# EAGLE schematic KarShield (EAGLE 7.2.0)
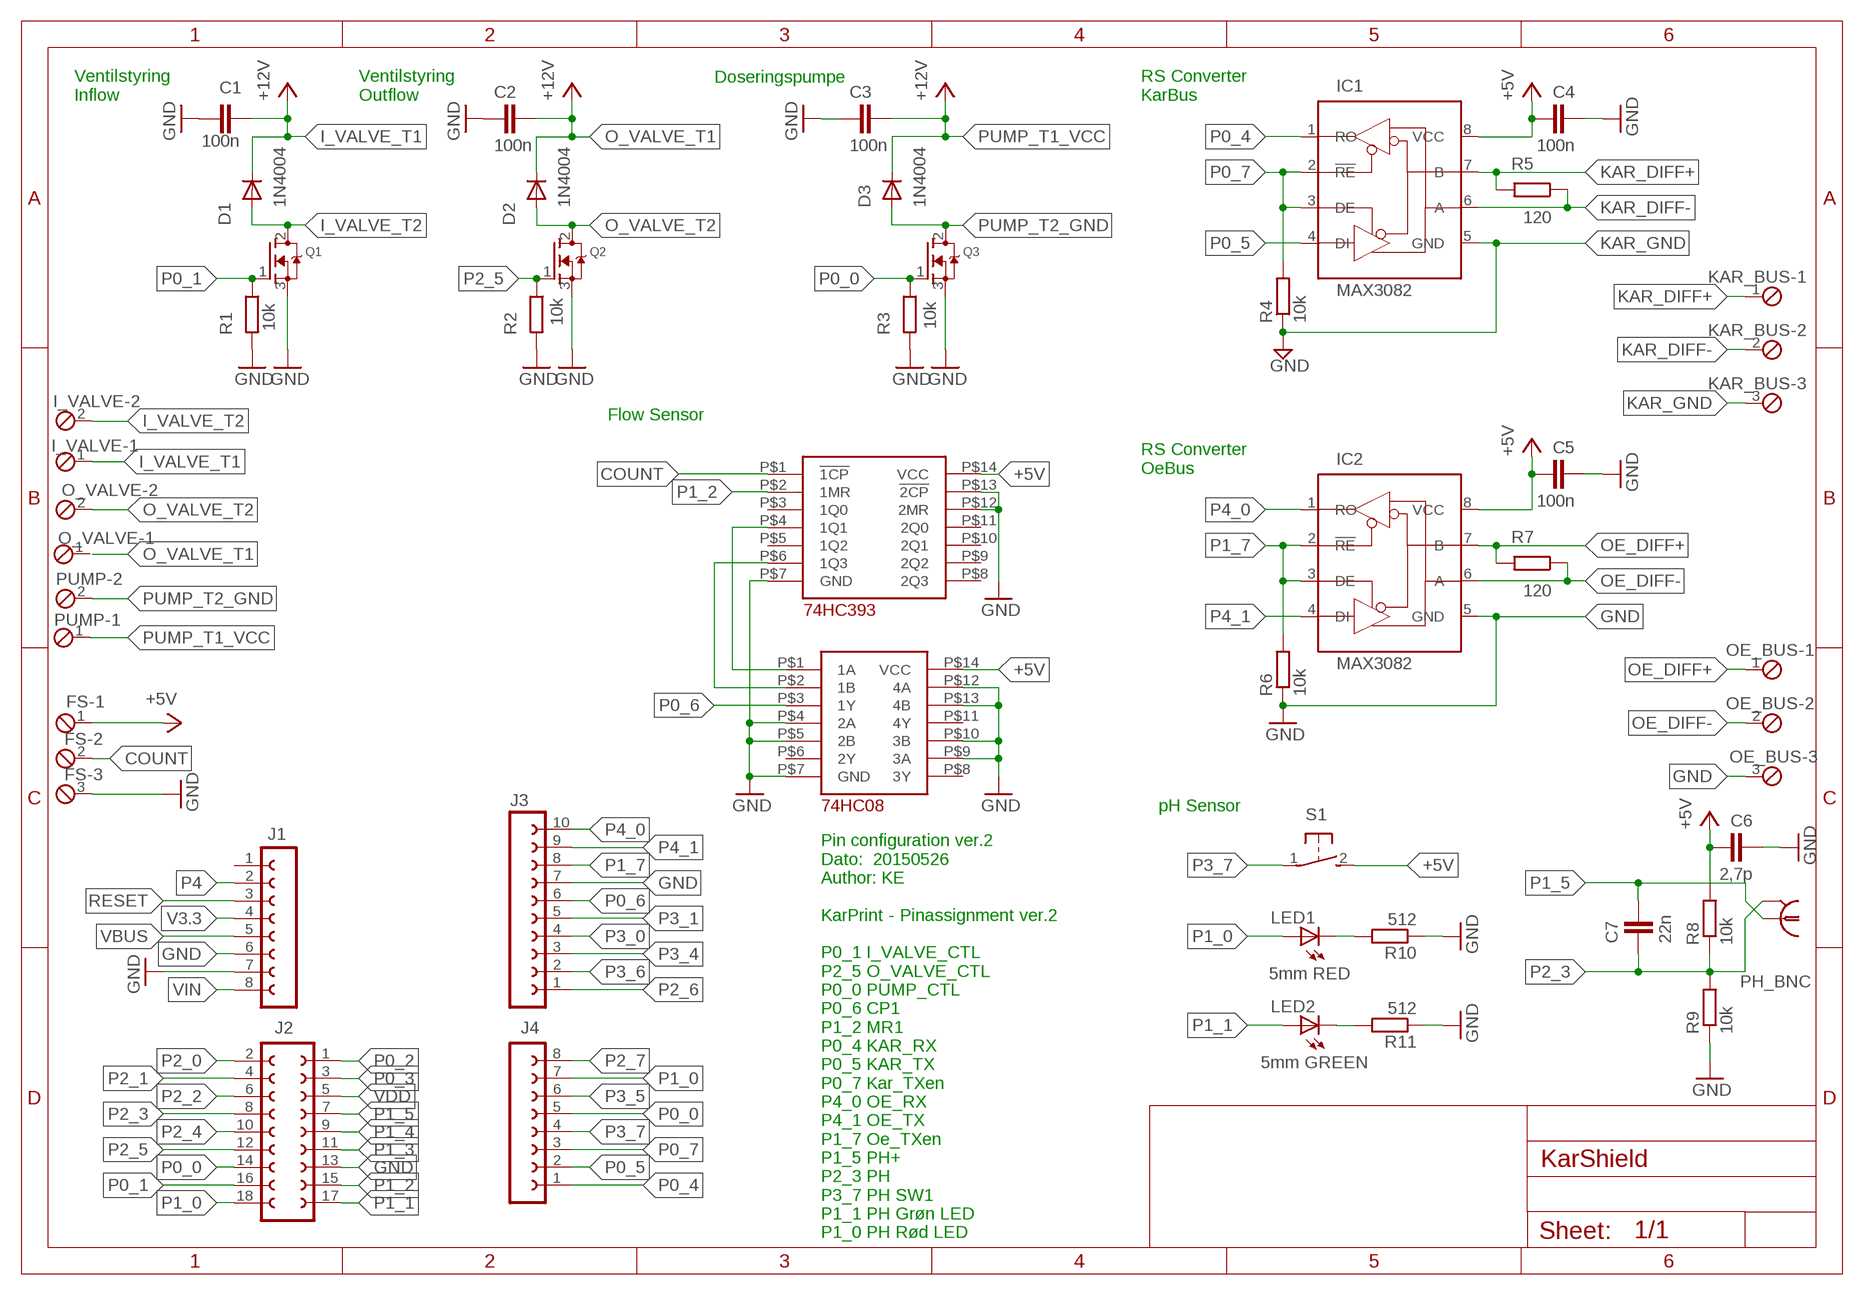
[diagram p0: schematic, sheet 1]

## Parts
74HC08  74HC08_KE  [74HC08_KE]
74HC393  HC74393_KEDIP14  [DIP14]
C1  100n  C5/3  [C5B3]
C2  100n  C5/3  [C5B3]
C3  100n  C5/3  [C5B3]
C4  100n  C5/3  [C5B3]
C5  100n  C5/3  [C5B3]
C6  2,7p  C5/3  [C5B3]
C7  22n  C5/3  [C5B3]
D1  1N4004  [DO41-10]
D2  1N4004  [DO41-10]
D3  1N4004  [DO41-10]
FS  MPT3  [3POL254]
I_VALVE  MPT2  [2POL254]
IC1  MAX3082  MAX3082CPD  [DIL08]
IC2  MAX3082  MAX3082CPD  [DIL08]
J1  FE08-1  [FE08]
J2  FE09-2  [FE09-2]
J3  FE10-1  [FE10]
J4  FE08-1  [FE08]
KAR_BUS  MPT3  [3POL254]
LED1  5mm RED  LED5MM  [LED5MM]
LED2  5mm GREEN  LED5MM  [LED5MM]
O_VALVE  MPT2  [2POL254]
OE_BUS  MPT3  [3POL254]
PH_BNC  1-227161-0  [AMP_227161]
PUMP  MPT2  [2POL254]
Q1  MOSFET-NGDS_TO220V  [TO220V]
Q2  MOSFET-NGDS_TO220V  [TO220V]
Q3  MOSFET-NGDS_TO220V  [TO220V]
R1  10k  R-EU_0207/12  [0207/12]
R2  10k  R-EU_0207/12  [0207/12]
R3  10k  R-EU_0207/12  [0207/12]
R4  10k  R-EU_0207/12  [0207/12]
R5  120  R-EU_0207/12  [0207/12]
R6  10k  R-EU_0207/12  [0207/12]
R7  120  R-EU_0207/12  [0207/12]
R8  10k  R-EU_0207/12  [0207/12]
R9  10k  R-EU_0207/12  [0207/12]
R10  512  R-EU_0207/12  [0207/12]
R11  512  R-EU_0207/12  [0207/12]
S1  31-XX  [B3F-31XX]

## Nets
+5V: 74HC08.P$14(VCC) 74HC393.P$14(VCC) FS.1 S1.2(S)
COUNT: 74HC393.P$1(!1CP!) FS.2
GND: 74HC08.P$4(2A) 74HC08.P$5(2B) 74HC08.P$7(GND) 74HC08.P$9(3A) 74HC08.P$10(3B) 74HC08.P$12(4A) 74HC08.P$13(4B) 74HC393.P$7(GND) 74HC393.P$12(2MR) 74HC393.P$13(!2CP!) C1.2 C2.2 C3.2 C4.2 C5.2 C6.2 FS.3 IC2.5(GND) J1.6 J1.7 J2.13 J3.7 OE_BUS.3 Q1.3(S) Q2.3(S) Q3.3(S) R1.2 R2.2 R3.2 R6.1 R9.1 R10.1 R11.1
I_VALVE_T1: C1.1 D1.C I_VALVE.1 ; supply symbol labelled +12V
I_VALVE_T2: D1.A I_VALVE.2 Q1.2(D)
KAR_DIFF+: IC1.7(B) KAR_BUS.1 R5.2
KAR_DIFF-: IC1.6(A) KAR_BUS.2 R5.1
KAR_GND: IC1.5(GND) KAR_BUS.3 R4.1 ; supply symbol labelled GND
N$3: LED1.K(C) R10.2
N$4: LED2.K(C) R11.2
N$8: 74HC08.P$1(1A) 74HC393.P$4(1Q1)
N$9: 74HC08.P$2(1B) 74HC393.P$6(1Q3)
O_VALVE_T1: C2.1 D2.C ; supply symbol labelled +12V
O_VALVE_T2: D2.A O_VALVE.2 Q2.2(D)
OE_DIFF+: IC2.7(B) OE_BUS.1 R7.2
OE_DIFF-: IC2.6(A) OE_BUS.2 R7.1
P0_0: J2.14 J4.5 Q3.1(G) R3.1
P0_1: J2.16 Q1.1(G) R1.1
P0_2: J2.1
P0_3: J2.3
P0_4: IC1.1(RO) J4.1
P0_5: IC1.4(DI) J4.2
P0_6: 74HC08.P$3(1Y) J3.6
P0_7: IC1.2(!RE!) IC1.3(DE) J4.3 R4.2
P1_0: J2.18 J4.7 LED1.A
P1_1: J2.17 LED2.A
P1_2: 74HC393.P$2(1MR) J2.15
P1_3: J2.11
P1_4: J2.9
P1_5: C7.1 J2.7 PH_BNC.1
P1_7: IC2.2(!RE!) IC2.3(DE) J3.8 R6.2
P2_0: J2.2
P2_1: J2.4
P2_2: J2.6
P2_3: C7.2 J2.8 PH_BNC.2 R8.1 R9.2
P2_4: J2.10
P2_5: J2.12 Q2.1(G) R2.1
P2_6: J3.1
P2_7: J4.8
P3_0: J3.4
P3_1: J3.5
P3_4: J3.3
P3_5: J4.6
P3_6: J3.2
P3_7: J4.4 S1.1(P)
P4: J1.2
P4_0: IC2.1(RO) J3.10
P4_1: IC2.4(DI) J3.9
PUMP_T1_VCC: C3.1 D3.C PUMP.1 ; supply symbol labelled +12V
PUMP_T2_GND: D3.A PUMP.2 Q3.2(D)
RESET: J1.3
V3.3: J1.4
VBUS: J1.5
VCC: C4.1 C5.1 C6.1 IC1.8(VCC) IC2.8(VCC) R8.2 ; supply symbol labelled +5V
VDD: J2.5
VIN: J1.8
Unconnected: 74HC08.P$6(2Y) 74HC08.P$8(3Y) 74HC08.P$11(4Y) 74HC393.P$3(1Q0) 74HC393.P$5(1Q2) 74HC393.P$8(2Q3) 74HC393.P$9(2Q2) 74HC393.P$10(2Q1) 74HC393.P$11(2Q0) J1.1 O_VALVE.1

## Notes on the sheet
- Doseringspumpe
- Ventilstyring
  Inflow
- Ventilstyring
  Outflow
- RS Converter
  KarBus
- Flow Sensor
- RS Converter
  OeBus
- pH Sensor
- Pin configuration ver.2
  Dato: 	20150526
  Author: KE
  
  KarPrint - Pinassignment ver.2
  
  P0_1 I_VALVE_CTL
  P2_5 O_VALVE_CTL	
  P0_0 PUMP_CTL
  P0_6 CP1			
  P1_2 MR1	
  P0_4 KAR_RX			
  P0_5 KAR_TX
  P0_7 Kar_TXen
  P4_0 OE_RX
  P4_1 OE_TX
  P1_7 Oe_TXen
  P1_5 PH+	
  P2_3 PH
  P3_7 PH SW1			
  P1_1 PH Grøn LED
  P1_0 PH Rød LED

## Library data of the parts
74HC08 = customIC:74HC08_KE
74HC393 = customIC:HC74393_KE
C1-C7 = capacitor-wima:C: CAPACITOR naming: grid - package width
D1-D3 = adafruit:1N4004: DIODE General purpose 1N400x type rectifier (With bigger pads) http://www.ladyada.net/library/pcb/eaglelibrary.html
FS KAR_BUS OE_BUS = con-phoenix-254:MPT3: PHOENIX CONNECTOR; OC_FARNELL: unknown; OC_NEWARK: unknown
I_VALVE O_VALVE PUMP = con-phoenix-254:MPT2: PHOENIX CONNECTOR; OC_FARNELL: unknown; OC_NEWARK: unknown
IC1 IC2 = myLibrary:MAX3082: RS485 transceiver Converting from logical RS232 to differential RS485, and vice versa.; OC_FARNELL: unknown; OC_NEWARK: unknown
J1 J4 = con-lsta:FE08-1: FEMALE HEADER; OC_FARNELL: unknown; OC_NEWARK: unknown
J2 = con-lsta:FE09-2: FEMALE HEADER; OC_FARNELL: unknown; OC_NEWARK: unknown
J3 = con-lsta:FE10-1: FEMALE HEADER; OC_FARNELL: unknown; OC_NEWARK: unknown
LED1 LED2 = adafruit:LED: LED OSRAM: - CHIPLED LG R971, LG N971, LY N971, LG Q971, LY Q971, LO R971, LY R971 LH N974, LH R974 LS Q976, LO Q976, LY Q976 LO Q996 - Hyper CHIPLED LW Q18S LB Q993, LB Q99A, LB R99A - SideLED LS A670, LO A670, LY A670, LG A670, LP A670 LB A673, LV A673, LT A673, LW A673 LH A674 LY A675 LS A676, LA A676, LO A676, LY A676, LW A676 LS A679, LY A679, LG A679 - Hyper Micro SIDELED® LS Y876, LA Y876, LO Y876, LY Y876 LT Y87S - SmartLED LW L88C, LW L88S LB L89C, LB L89S, LG L890 LS L89K, LO L89K, LY L89K LS L896, LA L896, LO L896, LY L896 - TOPLED LS T670, LO T670, LY T670, LG T670, LP T670 LSG T670, LSP T670, LSY T670, LOP T670, LYG T670 LG T671, LOG T671, LSG T671 LB T673, LV T673, LT T673, LW T673 LH T674 LS T676, LA T676, LO T676, LY T676, LB T676, LH T676, LSB T676, LW T676 LB T67C, LV T67C, LT T67C, LS T67K, LO T67K, LY T67K, LW E67C LS E67B, LA E67B, LO E67B, LY E67B, LB E67C, LV E67C, LT E67C LW T67C LS T679, LY T679, LG T679 LS T770, LO T770, LY T770, LG T770, LP T770 LB T773, LV T773, LT T773, LW T773 LH T774 LS E675, LA E675, LY E675, LS T675 LS T776, LA T776, LO T776, LY T776, LB T776 LHGB T686 LT T68C, LB T68C - Hyper Mini TOPLED® LB M676 - Mini TOPLED Santana® LG M470 LS M47K, LO M47K, LY M47K Source: http://www.osram.convergy.de/
PH_BNC = con-coax:?227161*: JACK, RIGHT ANGLE, 50 OHM, PCB, BNC Source: amp_227161.pdf; MF: TYCO ELECTRONICS; MPN: 1-227161; OC_FARNELL: unknown; OC_NEWARK: 33B3200
Q1-Q3 = adafruit:MOSFET-N: N-Channel Mosfet 2N7002E - 60V 260mA SOT23 [Digikey: 2N7002ET1GOSTR-ND] - REEL BSH103 - 30V 850mA SOT23 [Digikey: 568-5013-1-ND]
R1-R11 = resistor:R-EU_: RESISTOR, European symbol
S1 = switch-omron:31-XX: OMRON SWITCH; MPN: B3F-3100; OC_FARNELL: 959704; OC_NEWARK: 36M3582